# Altium project Adapter_DIP_AVR.PrjPcb
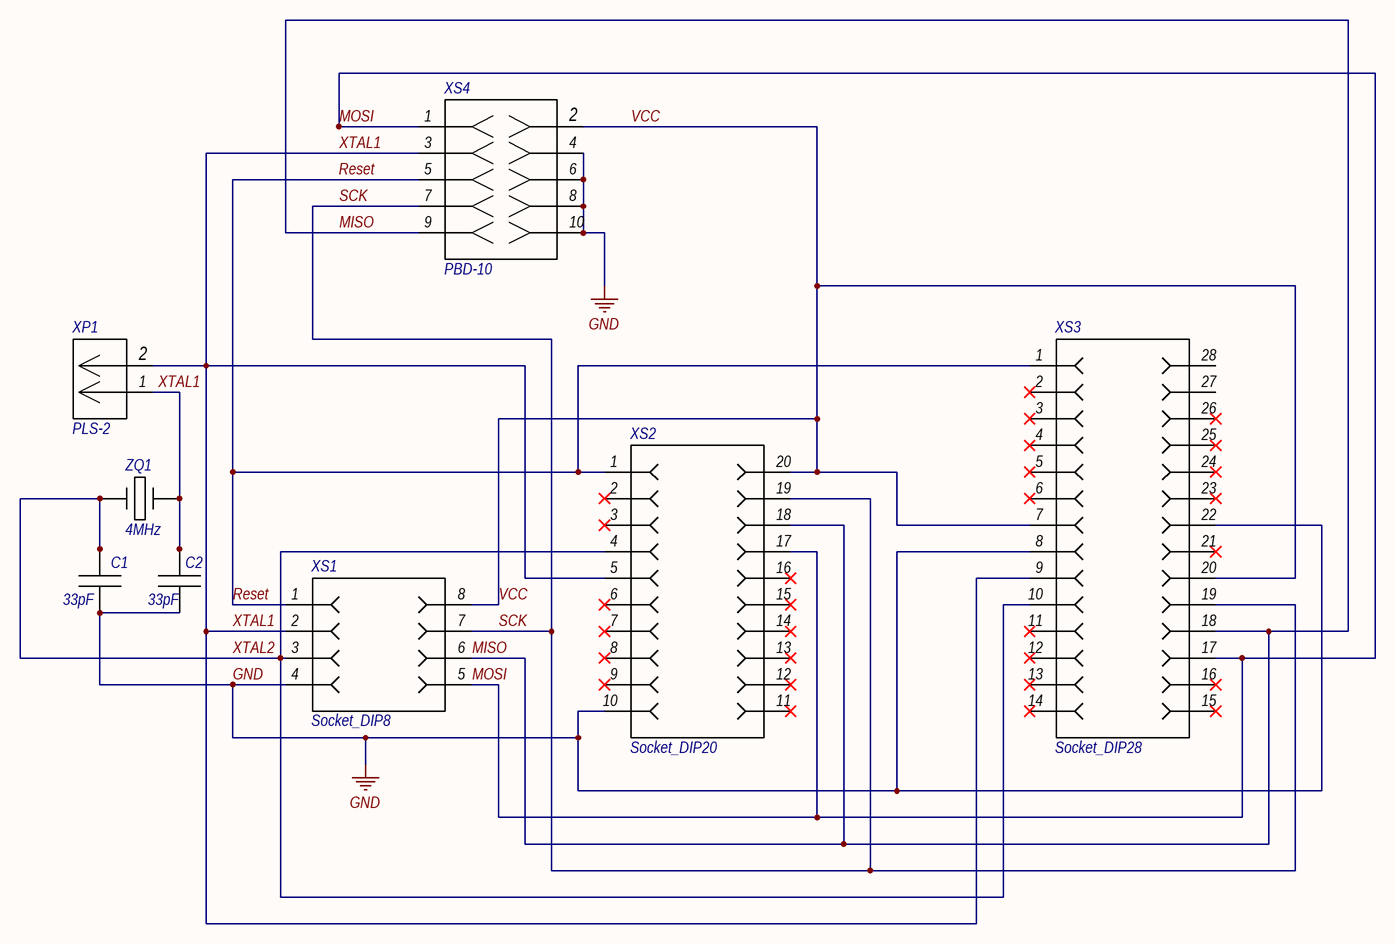
[diagram p0: Adapter_DIP_AVR.SchDoc]
1 sheet, 8 parts. Net scope: global (net labels, ports and power ports of the same name join across sheets).
Board file: Adapter_DIP_AVR.PcbDoc

## Sheet Adapter_DIP_AVR.SchDoc
size 420 x 297 mm; Address1: Address1; Address2: Address2; Address3: Address3; Address4: Address4; SheetNumber: 1; Scale: 1:1; Разраб.: Иванов; Обозначение документа: АБВГ.123456.001 Э3; Пров.: Петров; Утв.: Сидоров; Наименование организации: ОАО "Концерн "МПО-Гидроприбор"; Перв. применение: АБВГ.123456.000; Наименование изделия 1: Плата; Наименование изделия 2: Схема электрическая; Наименование изделия 3: принципиальная; Нач. отд.: Нач. отд.; Фамилия нач. отд.: Сидоров

### Parts
C1  33pF  [Capasitors]
C2  33pF  [Capasitors]
XP1  PLS-2  [PLS-2]
XS1  Socket_DIP8  [Socket_DIP8]
XS2  Socket_DIP20  [Socket_DIP20]
XS3  Socket_DIP28  [Socket_DIP28]
XS4  PBD-10  [PBD-10]
ZQ1  4MHz  [HC-49S]

### Nets
GND: C1.1 C2.1 XS1.4 XS2.10 XS3.8 XS3.22 XS4.4 XS4.6 XS4.8 XS4.10
MISO: XS1.6 XS2.18 XS3.18 XS4.9
MOSI: XS1.5 XS2.17 XS3.17 XS4.1
Reset: XS1.1 XS2.1 XS3.1 XS4.5
SCK: XS1.7 XS2.19 XS3.19 XS4.7
VCC: XS1.8 XS2.20 XS3.7 XS3.20 XS4.2
XTAL1: C2.2 XP1.1 XP1.2 XS1.2 XS2.5 XS3.9 XS4.3 ZQ1.2
XTAL2: C1.2 XS1.3 XS2.4 XS3.10 ZQ1.1

Not connected (* = marked no-connect by the designer): XS2 2* 3* 6* 7* 8* 9* 11* 12* 13* 14* 15* 16*; XS3 2* 3* 4* 5* 6* 11* 12* 13* 14* 15* 16* 21* 23* 24* 25* 26* 27 28

### Notes on the sheet
- Перв. примен.
- Справ. №
- Подп. и дата
- Инв. № дубл.
- Взам. инв. №
- Разраб.
- Изм.
- Лист
- № докум.
- Подп.
- Дата
- Лит.
- Масса
- Масштаб
- Пров.
- Т.контр.
- Листов
- Инв. № подл.
- Утв.
- Н.контр.
- Копировал
- Формат А3

### Library data of the parts
C1 C2 = CAP
ZQ1 = Crystal